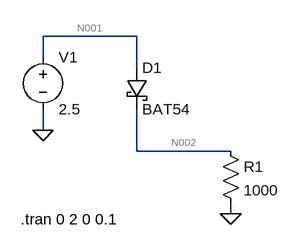
[diagram p0: schematic Draft1.asc]
Draft1.asc, the LTspice schematic file:
Version 4
SHEET 1 880 680
WIRE 48 32 -96 32
WIRE -96 64 -96 32
WIRE 48 80 48 32
WIRE -96 176 -96 144
WIRE 48 208 48 144
WIRE 192 208 48 208
WIRE 192 304 192 288
FLAG -96 176 0
FLAG 192 304 0
SYMBOL schottky 32 80 R0
SYMATTR InstName D1
SYMATTR Value BAT54
SYMATTR Description Diode
SYMATTR Type diode
SYMBOL voltage -96 48 R0
WINDOW 123 0 0 Left 2
WINDOW 39 0 0 Left 2
SYMATTR InstName V1
SYMATTR Value 2.5
SYMBOL res 176 192 R0
SYMATTR InstName R1
SYMATTR Value 1000
TEXT -130 312 Left 2 !.tran 0 2 0 0.1

The netlist it stands for:
* Draft1.asc
D1 N001 N002 BAT54
V1 N001 0 2.5
R1 N002 0 1000
.model D D
.lib standard.dio
.tran 0 2 0 0.1
.backanno
.end

* Results of the author's LTspice run, read from the files saved beside the schematic
* Operating Point, zero values left out:
*   V(n001) = 2.5 V
*   V(n002) = 2.236 V
*   I(D1) = 2.236 mA
*   I(R1) = 2.236 mA
*   I(V1) = -2.236 mA
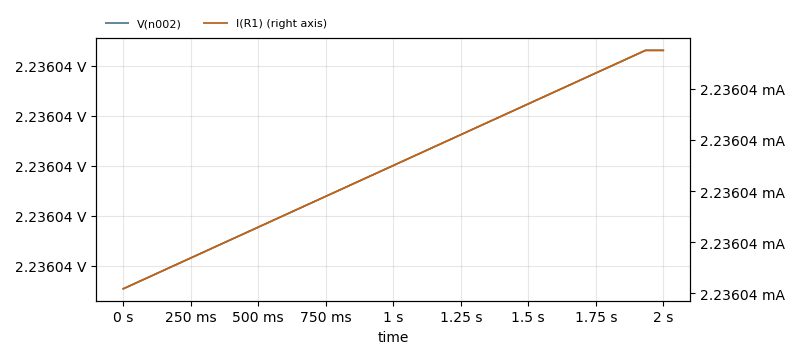
[diagram p1: Transient Analysis of Draft1.asc, plotted from the saved traces]
* Transient Analysis, 1 run:
*   V(n002): min 2.236 V, max 2.236 V, average 2.236 V, rms 2.236 V, last 2.236 V
*   I(R1): min 2.236 mA, max 2.236 mA, average 2.236 mA, rms 2.236 mA, last 2.236 mA